# Altium schematic sheet [5]_Analog_input_filters.SchDoc: Analog inputs & filters
size A4; DocumentNumber: 5; SheetNumber: 5; SheetTotal: 8
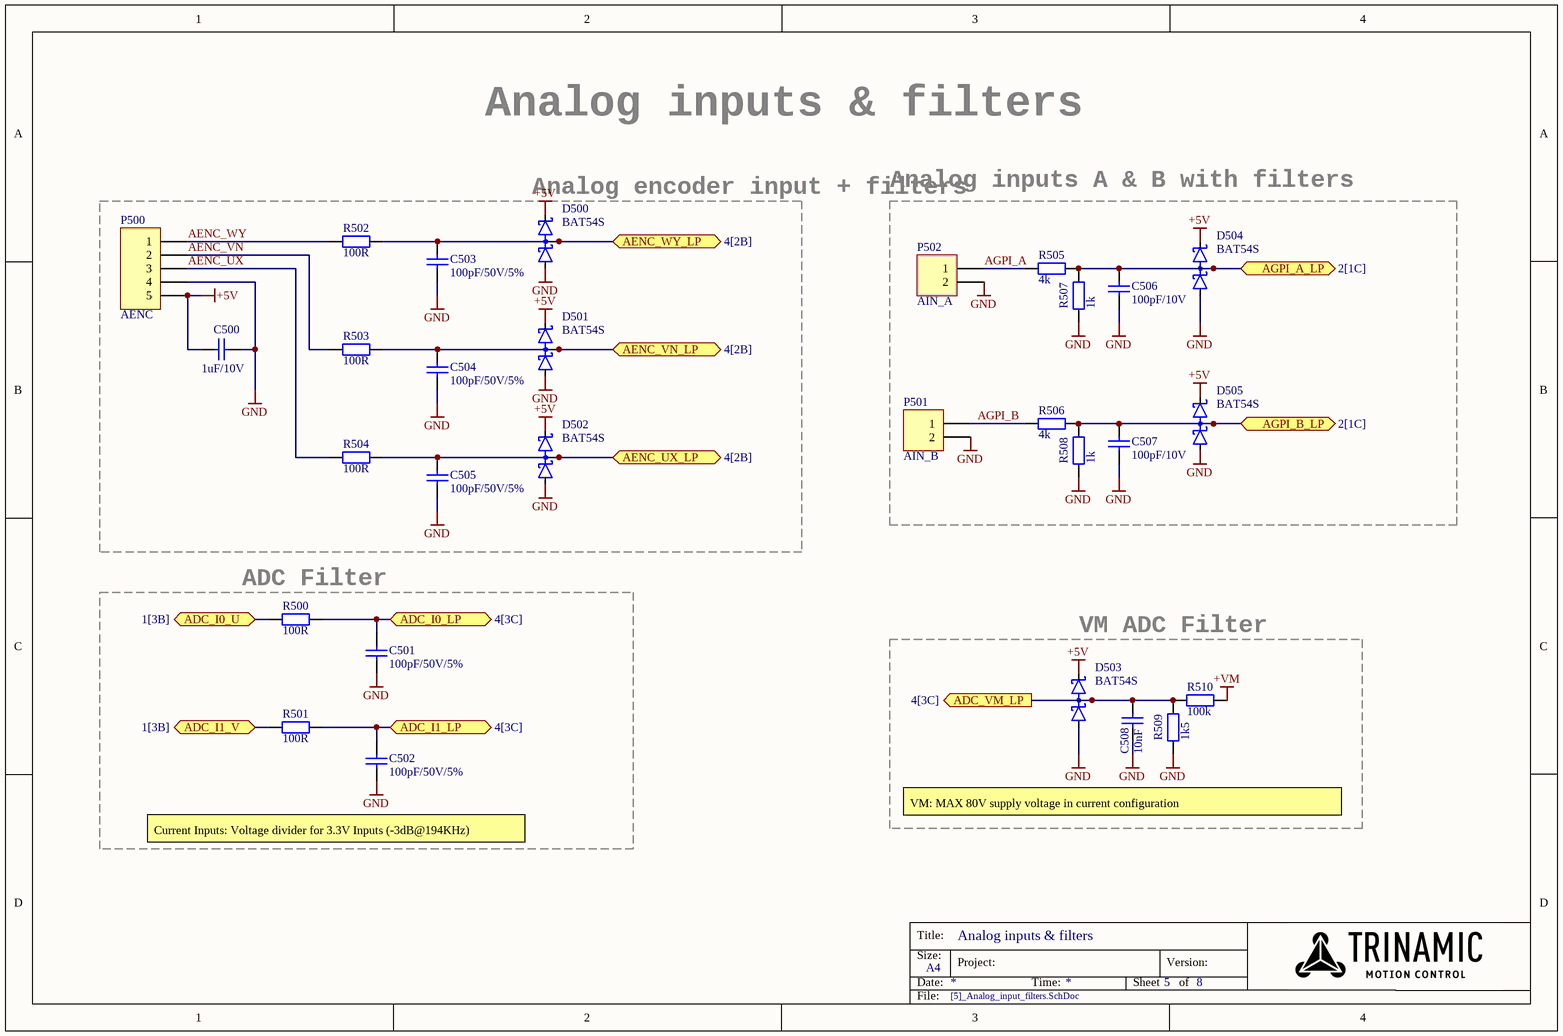
[diagram p0: [5]_Analog_input_filters.SchDoc]

## Parts
C500  1uF/10V  [C0603]
C501  100pF/50V/5%  [C0603]
C502  100pF/50V/5%  [C0603]
C503  100pF/50V/5%  [C0603]
C504  100pF/50V/5%  [C0603]
C505  100pF/50V/5%  [C0603]
C506  100pF/10V  [C0603]
C507  100pF/10V  [C0603]
C508  10nF  [C0603]
D500  BAT54S  [SOT95P237X130-3N]
D501  BAT54S  [SOT95P237X130-3N]
D502  BAT54S  [SOT95P237X130-3N]
D503  BAT54S  [SOT95P237X130-3N]
D504  BAT54S  [SOT95P237X130-3N]
D505  BAT54S  [SOT95P237X130-3N]
P500  AENC  [TH_HDR_1X5]
P501  AIN_B  [TH_HDR_1X2]
P502  AIN_A  [TH_HDR_1X2]
R500  100R  [R0603]
R501  100R  [R0603]
R502  100R  [R0603]
R503  100R  [R0603]
R504  100R  [R0603]
R505  4k  [R0805]
R506  4k  [R0805]
R507  1k  [R0603]
R508  1k  [R0603]
R509  1k5  [R0603]
R510  100k  [R0603]

## Blocks framed on the sheet
Analog encoder input + filters: C500 C503-C505 D500-D502 P500 R502-R504
Analog inputs A & B with filters: C506 C507 D504 D505 P501 P502 R505-R508
ADC Filter: C501 C502 R500 R501

## Ports
ADC_I0_LP (see 4[3C]), ADC_I0_U (see 1[3B]), ADC_I1_LP (see 4[3C]), ADC_I1_V (see 1[3B]), ADC_VM_LP (out, see 4[3C]), AENC_UX_LP (see 4[2B]), AENC_VN_LP (see 4[2B]), AENC_WY_LP (see 4[2B]), AGPI_A_LP (see 2[1C]), AGPI_B_LP (see 2[1C])

## Nets
+5V: C500.2 D500.2(C2) D501.2(C2) D502.2(C2) D503.2(C2) D504.2(C2) D505.2(C2) P500.5
+VM: R510.2
GND: C500.1 C501.1 C502.1 C503.1 C504.1 C505.1 C506.1 C507.1 C508.1 D500.1(A1) D501.1(A1) D502.1(A1) D503.1(A1) D504.1(A1) D505.1(A1) P500.4 P501.2 P502.2 R507.2 R508.2 R509.2
ADC_I0_LP: C501.2 R500.1 ; port ADC_I0_LP
ADC_I0_U: R500.2 ; port ADC_I0_U
ADC_I1_LP: C502.2 R501.1 ; port ADC_I1_LP
ADC_I1_V: R501.2 ; port ADC_I1_V
ADC_VM_LP: C508.2 D503.3(C1A2) R509.1 R510.1 ; port ADC_VM_LP
AENC_UX: P500.3 R504.2
AENC_UX_LP: C505.2 D502.3(C1A2) R504.1 ; port AENC_UX_LP
AENC_VN: P500.2 R503.2
AENC_VN_LP: C504.2 D501.3(C1A2) R503.1 ; port AENC_VN_LP
AENC_WY: P500.1 R502.2
AENC_WY_LP: C503.2 D500.3(C1A2) R502.1 ; port AENC_WY_LP
AGPI_A: P502.1 R505.2
AGPI_A_LP: C506.2 D504.3(C1A2) R505.1 R507.1 ; port AGPI_A_LP
AGPI_B: P501.1 R506.2
AGPI_B_LP: C507.2 D505.3(C1A2) R506.1 R508.1 ; port AGPI_B_LP

## Notes on the sheet
- (near D503) VM ADC Filter
- (near C502) Current Inputs: Voltage divider for 3.3V Inputs (-3dB@194KHz)
- VM: MAX 80V supply voltage in current configuration
- Title:
- Size:
- Date:
- A4
- Project:
- Time:
- Sheet
- Version:
- of
- File:

## Library data of the parts
C500 = C, 1 µF, 10 V, ± 10%, X5R, MC Series, 0603 [1608 Metric]: SMD Multilayer Ceramic Capacitor, 0603 [1608 Metric], 1 µF, 10 V, ± 10%, X5R, MC Series; MPN: MC0603X105K100CT; Type: MLCC; VoltageRating: 10V; MF: MULTICOMP; Capacitance: 1uF; Characteristic: X5R; Precision: 10%
C501-C505 = C, 100 pF, 50 V, ± 5%, C0G / NP0, MC Series, 0603 [1608 Metric]: SMD Multilayer Ceramic Capacitor, 0603 [1608 Metric], 100 pF, 50 V, ± 5%, C0G / NP0, MC Series; MPN: MC0603N101J500CT; Type: MLCC; VoltageRating: 50V; MF: MULTICOMP; Capacitance: 100pF; Characteristic: C0G / NP0; Precision: 5%
C506 C507 = C, 100 pF, 10 V, ± 1%, C0G / NP0, MCMT Series, 0603 [1608 Metric]: SMD Multilayer Ceramic Capacitor, 0603 [1608 Metric], 100 pF, 10 V, ± 1%, C0G / NP0, MCMT Series; MPN: MCMT18N101F100CT; Type: MLCC; VoltageRating: 10V; MF: MULTICOMP; Capacitance: 100pF; Characteristic: C0G / NP0; Precision: 1%
C508 = C, 10nF, 10 V, ± 10%, X7R, 0603: SMD Multilayer Ceramic Capacitor, 0603 [1608 Metric], 0.01 µF, 10 V, ± 10%, X7R, MCSH Series; MPN: MCSH18B103K100CT; Type: MLCC; VoltageRating: 10V; MF: MULTICOMP; Characteristic: X7R; Capacitance: 10nF; Precision: 10%
D500-D505 = BAT54S: Small Signal Schottky Diode, Dual Series, 30 V, 200 mA, 1 V, 600 mA, 125 °C; MF: TAIWAN SEMICONDUCTOR; MPN: BAT54S
P500 = Header 5: Header, 5-Pin
P501 P502 = Header 2: Header, 2-Pin
R500-R504 = R, 100 ohm, 50 V, 0603 [1608 Metric], 100 mW, ± 1%, MCWR Series: SMD Chip Resistor, Thick Film, 100 ohm, 50 V, 0603 [1608 Metric], 100 mW, ± 1%, MCWR Series; MPN: MCWR06X1000FTL; VoltageRating: 50V; Temp coefficient: *ppm; PowerRating: 100mW; MF: MULTICOMP; Precision: 1%; Resistance: 100R
R505 R506 = R, 4 kohm, 150 V, 0805 [2012 Metric], 125 mW, ± 1%, CRCW Series: SMD Chip Resistor, Thick Film, 4 kohm, 150 V, 0805 [2012 Metric], 125 mW, ± 1%, CRCW Series; MPN: CRCW08054K00FKTA; VoltageRating: 150V; Temp coefficient: *ppm; PowerRating: 125mW; MF: VISHAY; Precision: 1%; Resistance: 4k
R507 R508 = R, 1 kohm, 50 V, 0603 [1608 Metric], 63 mW, ± 1%, MC Series: SMD Chip Resistor, Thick Film, 1 kohm, 50 V, 0603 [1608 Metric], 100 mW, ± 0.5%, RE Series; MPN: MC0063W060311K; Precision: 1%; VoltageRating: 50V; Temp coefficient: *ppm; PowerRating: 63mW; MF: MULTICOMP; Resistance: 1k
R509 = R, 1.5 kohm, 50 V, 0603 [1608 Metric], 100 mW, ± 1%, MCWR Series: SMD Chip Resistor, Thick Film, 1.5 kohm, 50 V, 0603 [1608 Metric], 100 mW, ± 1%, MCWR Series; MPN: MCWR06X1501FTL; VoltageRating: 50V; Temp coefficient: *ppm; PowerRating: 63mW; MF: MULTICOMP; Precision: 1%; Resistance: 1k5
R510 = R, 100 kohm, 50 V, 0603 [1608 Metric], 100 mW, ± 1%, MCWR Series: SMD Chip Resistor, Thick Film, 100 kohm, 50 V, 0603 [1608 Metric], 100 mW, ± 1%, MCWR Series; MPN: MCWR06X1003FTL; Temp coefficient: *ppm; MF: MULTICOMP; Precision: 1%; Resistance: 100k